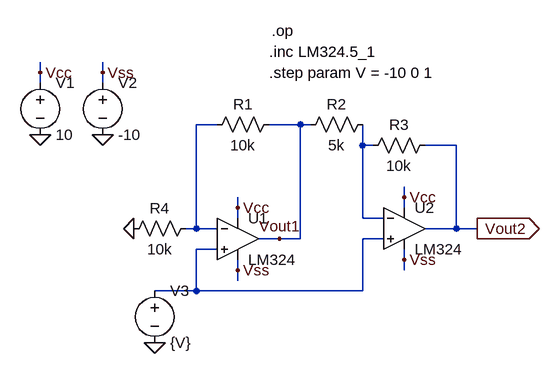
[diagram p0: schematic TPSRA1.32.asc]
TPSRA1.32.asc, the LTspice schematic file:
Version 4
SHEET 1 880 680
WIRE 16 -160 16 -176
WIRE 112 -160 112 -176
WIRE 16 -144 16 -160
WIRE 112 -144 112 -160
WIRE 288 -80 256 -80
WIRE 416 -80 368 -80
WIRE 432 -80 416 -80
WIRE 512 -48 512 -80
WIRE 528 -48 512 -48
WIRE 656 -48 608 -48
WIRE 576 32 576 16
WIRE 320 48 320 32
WIRE 576 48 576 32
WIRE 320 64 320 48
WIRE 512 64 512 -48
WIRE 544 64 512 64
WIRE 256 80 256 -80
WIRE 256 80 240 80
WIRE 288 80 256 80
WIRE 656 80 656 -48
WIRE 656 80 608 80
WIRE 688 80 656 80
WIRE 384 96 352 96
WIRE 416 96 416 -80
WIRE 416 96 384 96
WIRE 544 96 512 96
WIRE 288 112 256 112
WIRE 576 128 576 112
WIRE 320 144 320 128
WIRE 576 144 576 128
WIRE 320 160 320 144
WIRE 256 176 256 112
WIRE 256 176 192 176
WIRE 512 176 512 96
WIRE 512 176 256 176
FLAG 160 80 0
FLAG 688 80 Vout2
IOPIN 688 80 Out
FLAG 112 -64 0
FLAG 16 -64 0
FLAG 16 -160 Vcc
FLAG 112 -160 Vss
FLAG 320 48 Vcc
FLAG 320 144 Vss
FLAG 576 32 Vcc
FLAG 576 128 Vss
FLAG 192 256 0
FLAG 384 96 Vout1
SYMBOL Opamps\\opamp2 320 32 R0
SYMATTR InstName U1
SYMATTR Value LM324
SYMBOL Opamps\\opamp2 576 16 R0
SYMATTR InstName U2
SYMATTR Value LM324
SYMBOL res 384 -96 R90
WINDOW 0 0 56 VBottom 2
WINDOW 3 32 56 VTop 2
SYMATTR InstName R1
SYMATTR Value 10k
SYMBOL res 528 -96 R90
WINDOW 0 0 56 VBottom 2
WINDOW 3 32 56 VTop 2
SYMATTR InstName R2
SYMATTR Value 5k
SYMBOL res 624 -64 R90
WINDOW 0 0 56 VBottom 2
WINDOW 3 32 56 VTop 2
SYMATTR InstName R3
SYMATTR Value 10k
SYMBOL res 256 64 R90
WINDOW 0 0 56 VBottom 2
WINDOW 3 32 56 VTop 2
SYMATTR InstName R4
SYMATTR Value 10k
SYMBOL voltage 16 -160 R0
SYMATTR InstName V1
SYMATTR Value 10
SYMBOL voltage 112 -160 R0
SYMATTR InstName V2
SYMATTR Value -10
SYMBOL voltage 192 160 R0
SYMATTR InstName V3
SYMATTR Value {V}
TEXT 368 -192 Left 2 !.inc LM324.5_1
TEXT 368 -160 Left 2 !.step param V = -10 0 1
TEXT 372 -224 Left 2 !.op

The netlist it stands for:
* TPSRA1.32.asc
XU1 N003 N001 Vcc Vss Vout1 LM324  ; pins In+ In- V+ V- OUT
XU2 N003 N002 Vcc Vss Vout2 LM324  ; pins In+ In- V+ V- OUT
R1 Vout1 N001 10k
R2 N002 Vout1 5k
R3 Vout2 N002 10k
R4 N001 0 10k
V1 Vcc 0 10
V2 Vss 0 -10
V3 N003 0 {V}
.inc LM324.5_1
.step param V = -10 0 1
.op
.backanno
.end